# EAGLE design Bi-Direction Logic Level Converter (EAGLE 9.6.2)
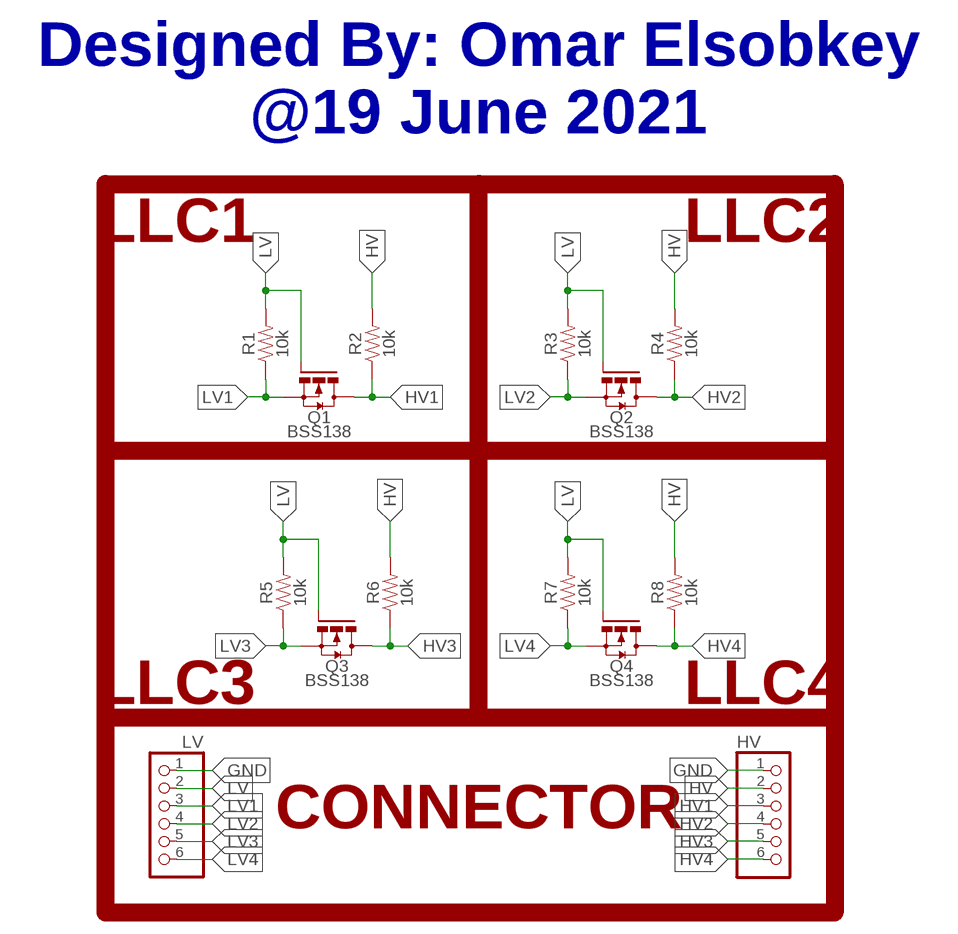
[diagram p0: schematic, sheet 1]

## Parts
HV  PINHD-1X6  [1X06]
LV  PINHD-1X6  [1X06]
Q1  BSS138  [SOT23-3]
Q2  BSS138  [SOT23-3]
Q3  BSS138  [SOT23-3]
Q4  BSS138  [SOT23-3]
R1  10k  RESISTOR1206  [1206]
R2  10k  RESISTOR1206  [1206]
R3  10k  RESISTOR1206  [1206]
R4  10k  RESISTOR1206  [1206]
R5  10k  RESISTOR1206  [1206]
R6  10k  RESISTOR1206  [1206]
R7  10k  RESISTOR1206  [1206]
R8  10k  RESISTOR1206  [1206]

## Nets
GND: HV.1 LV.1
HV: HV.2 R2.2 R4.2 R6.2 R8.2
HV1: HV.3 Q1.3(D) R2.1
HV2: HV.4 Q2.3(D) R4.1
HV3: HV.5 Q3.3(D) R6.1
HV4: HV.6 Q4.3(D) R8.1
LV: LV.2 Q1.1(G) Q2.1(G) Q3.1(G) Q4.1(G) R1.2 R3.2 R5.2 R7.2
LV1: LV.3 Q1.2(S) R1.1
LV2: LV.4 Q2.2(S) R3.1
LV3: LV.5 Q3.2(S) R5.1
LV4: LV.6 Q4.2(S) R7.1

## Notes on the sheet
- Designed By: Omar Elsobkey
  @19 June 2021
- LLC1 | LLC2
- LLC3 | LLC4
- CONNECTOR

## Library data of the parts
HV LV = pinhead:PINHD-1X6: PIN HEADER
Q1-Q4 = Transistor:BSS138: MOSFET N-CH 50V 220MA SOT-23 Manufacturer's datasheet <https://www.onsemi.com/pub/Collateral/BSS138-D.PDF>; CREATED_BY: PCBLayout.com; DIGIKEY_PART_NUMBER: BSS138CT-ND; MANUFACTURER: ON Semiconductor; MPN: BSS138; PACKAGE: SOT-23
R1-R8 = SparkFun-Resistors:RESISTOR: Generic Resistor Package

## Board
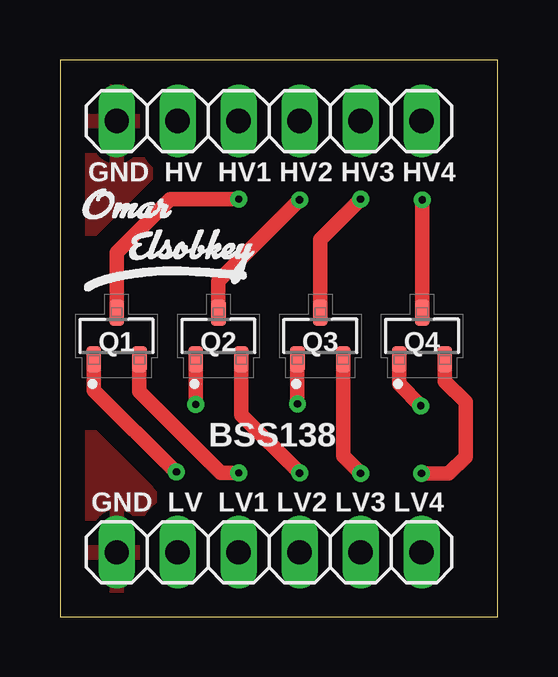
[diagram p1: board, top side]
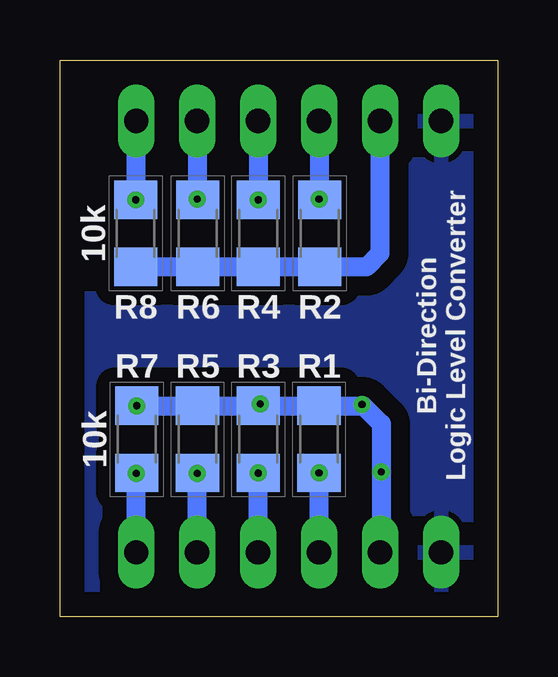
[diagram p2: board, bottom side, seen from below]

Size 18.24 x 23.22 mm. Coordinates in mm from the lower left corner, seen from the top.
Outline: 0,0 18.24,0 18.24,23.22 0,23.22 0,0
Copper layers (1*16): Top 0.035mm / dielectric 1.5mm / Bottom 0.035mm
Design rules "default *": minimum track width 0.6mm, minimum drill 0.2mm, track to track 0.6mm, track to pad 0.6mm, pad to pad 0.6mm, via to via 0.6mm, smd to smd 0.6mm, copper to edge 40mil, drill to drill 6mil, minimum pad ring 10mil, minimum via ring 8mil, stop-mask expansion 4mil, vias tented up to drill 0mil, thermal gap 10mil

### Footprints (pad centres in the part's own frame; a part is rotated, then mirrored left to right if it is on the bottom)
1X06 = drill 1.016 long: 1 -6.35,0; 2 -3.81,0; 3 -1.27,0; 4 1.27,0; 5 3.81,0; 6 6.35,0
SOT23-3 = smd 0.62 x 1.1: 1 -0.95,-0.975; 2 0.95,-0.975; 3 0,0.975
1206 = smd 1.6 x 1.8: 1 -1.4,0; 2 1.4,0

### Placement (x,y rotation side)
HV  8.71,20.68 0 top
LV  8.71,2.69 0 top
Q1  2.36,11.71 0 top
Q2  6.6,11.71 0 top
Q3  10.85,11.71 0 top
Q4  15.09,11.71 0 top
R1  7.44,7.4 90 bottom
R2  7.42,15.99 270 bottom
R3  9.97,7.4 90 bottom
R4  9.98,15.99 270 bottom
R5  12.51,7.4 90 bottom
R6  12.5,15.99 270 bottom
R7  15.04,7.4 90 bottom
R8  15.09,15.99 270 bottom
U$1  [OMAR_ELSOBKEY_X0.5_TN]  4.17,15.52 0 top

### Tracks (layer width: path | path; a pad name or v marks a point on that pad's centre or on a via)
GND
  pour Top (isolate 0.8): -0.51,23.62 18.59,23.62 18.59,-0.36 -0.51,-0.36
  pour Bottom (isolate 0.8): -0.3,23.57 18.54,23.57 18.54,-0.38 -0.3,-0.38
HV
  Bottom 0.8: HV.2 4.91,15.15 5.47,14.59 R2.2 R4.2 R6.2 R8.2
HV1  (via drill 0.3)
  Top 0.6: 2.36,12.46 Q1.3 2.36,15.19 4.59,17.41 v7.44,17.41
  Bottom 0.8: HV.3 v7.44,17.41 R2.1
HV2  (via drill 0.3)
  Top 0.6: Q2.3 6.6,14.01 R4.1
  Bottom 0.8: HV.4 R4.1
  other vias: 9.98,17.39
HV3  (via drill 0.3)
  Top 0.6: 10.85,12.46 Q3.3 10.85,15.74 v12.52,17.41
  Bottom 0.8: HV.5 v12.52,17.41 R6.1
HV4  (via drill 0.3)
  Top 0.6: 15.09,12.46 Q4.3 R8.1
  Bottom 0.8: R8.1 15.09,20.65 HV.6
  other vias: 15.09,17.39
LV  (via drill 0.3)
  Top 0.6: v4.85,6.04 4.82,6.04 1.41,9.45 Q1.1 | Q4.1 14.14,9.7 R7.2 | Q3.1 v9.9,8.88 | Q2.1 v5.65,8.85
  Bottom 0.6: R3.2 v9.9,8.88 | 5.6,8.8 v5.65,8.85
  Bottom 0.8: R7.2 | R7.2 R5.2 R3.2 R1.2 5.6,8.8 4.85,8.05 v4.85,6.04 4.85,2.74 LV.2
  other vias: 15.04,8.8
LV1  (via drill 0.3)
  Top 0.6: Q1.2 3.31,9.4 6.71,6 R1.1
  Bottom 0.8: LV.3 R1.1
  other vias: 7.44,6
LV2  (via drill 0.3)
  Top 0.6: Q2.2 7.55,8.42 v9.98,6
  Bottom 0.8: LV.4 v9.98,6 R3.1
LV3  (via drill 0.3)
  Top 0.6: Q3.2 11.8,6.71 v12.52,5.99
  Bottom 0.8: LV.5 v12.52,5.99 R5.1
LV4  (via drill 0.3)
  Top 0.6: Q4.2 16.04,9.82 16.9,8.96 16.9,6.67 16.21,5.98 v15.06,5.98
  Bottom 0.8: LV.6 v15.06,5.98 R7.1

### Text on the board
tNames: GND HV HV1 HV2 HV3 HV4 | GND LV LV1 LV2 LV3 LV4
bNames: Bi-Direction / Logic Level Converter